# EasyEDA Pro project 电源拓展板.eprj

# Schematic Schematic1
Create Date: 2023-07-08; Page Name: P1; Project Name: 电源拓展板; Schematic Name: Schematic1; Update Date: 2023-07-08; Company: 嘉立创EDA; Page Size: A4; Version: V1.0
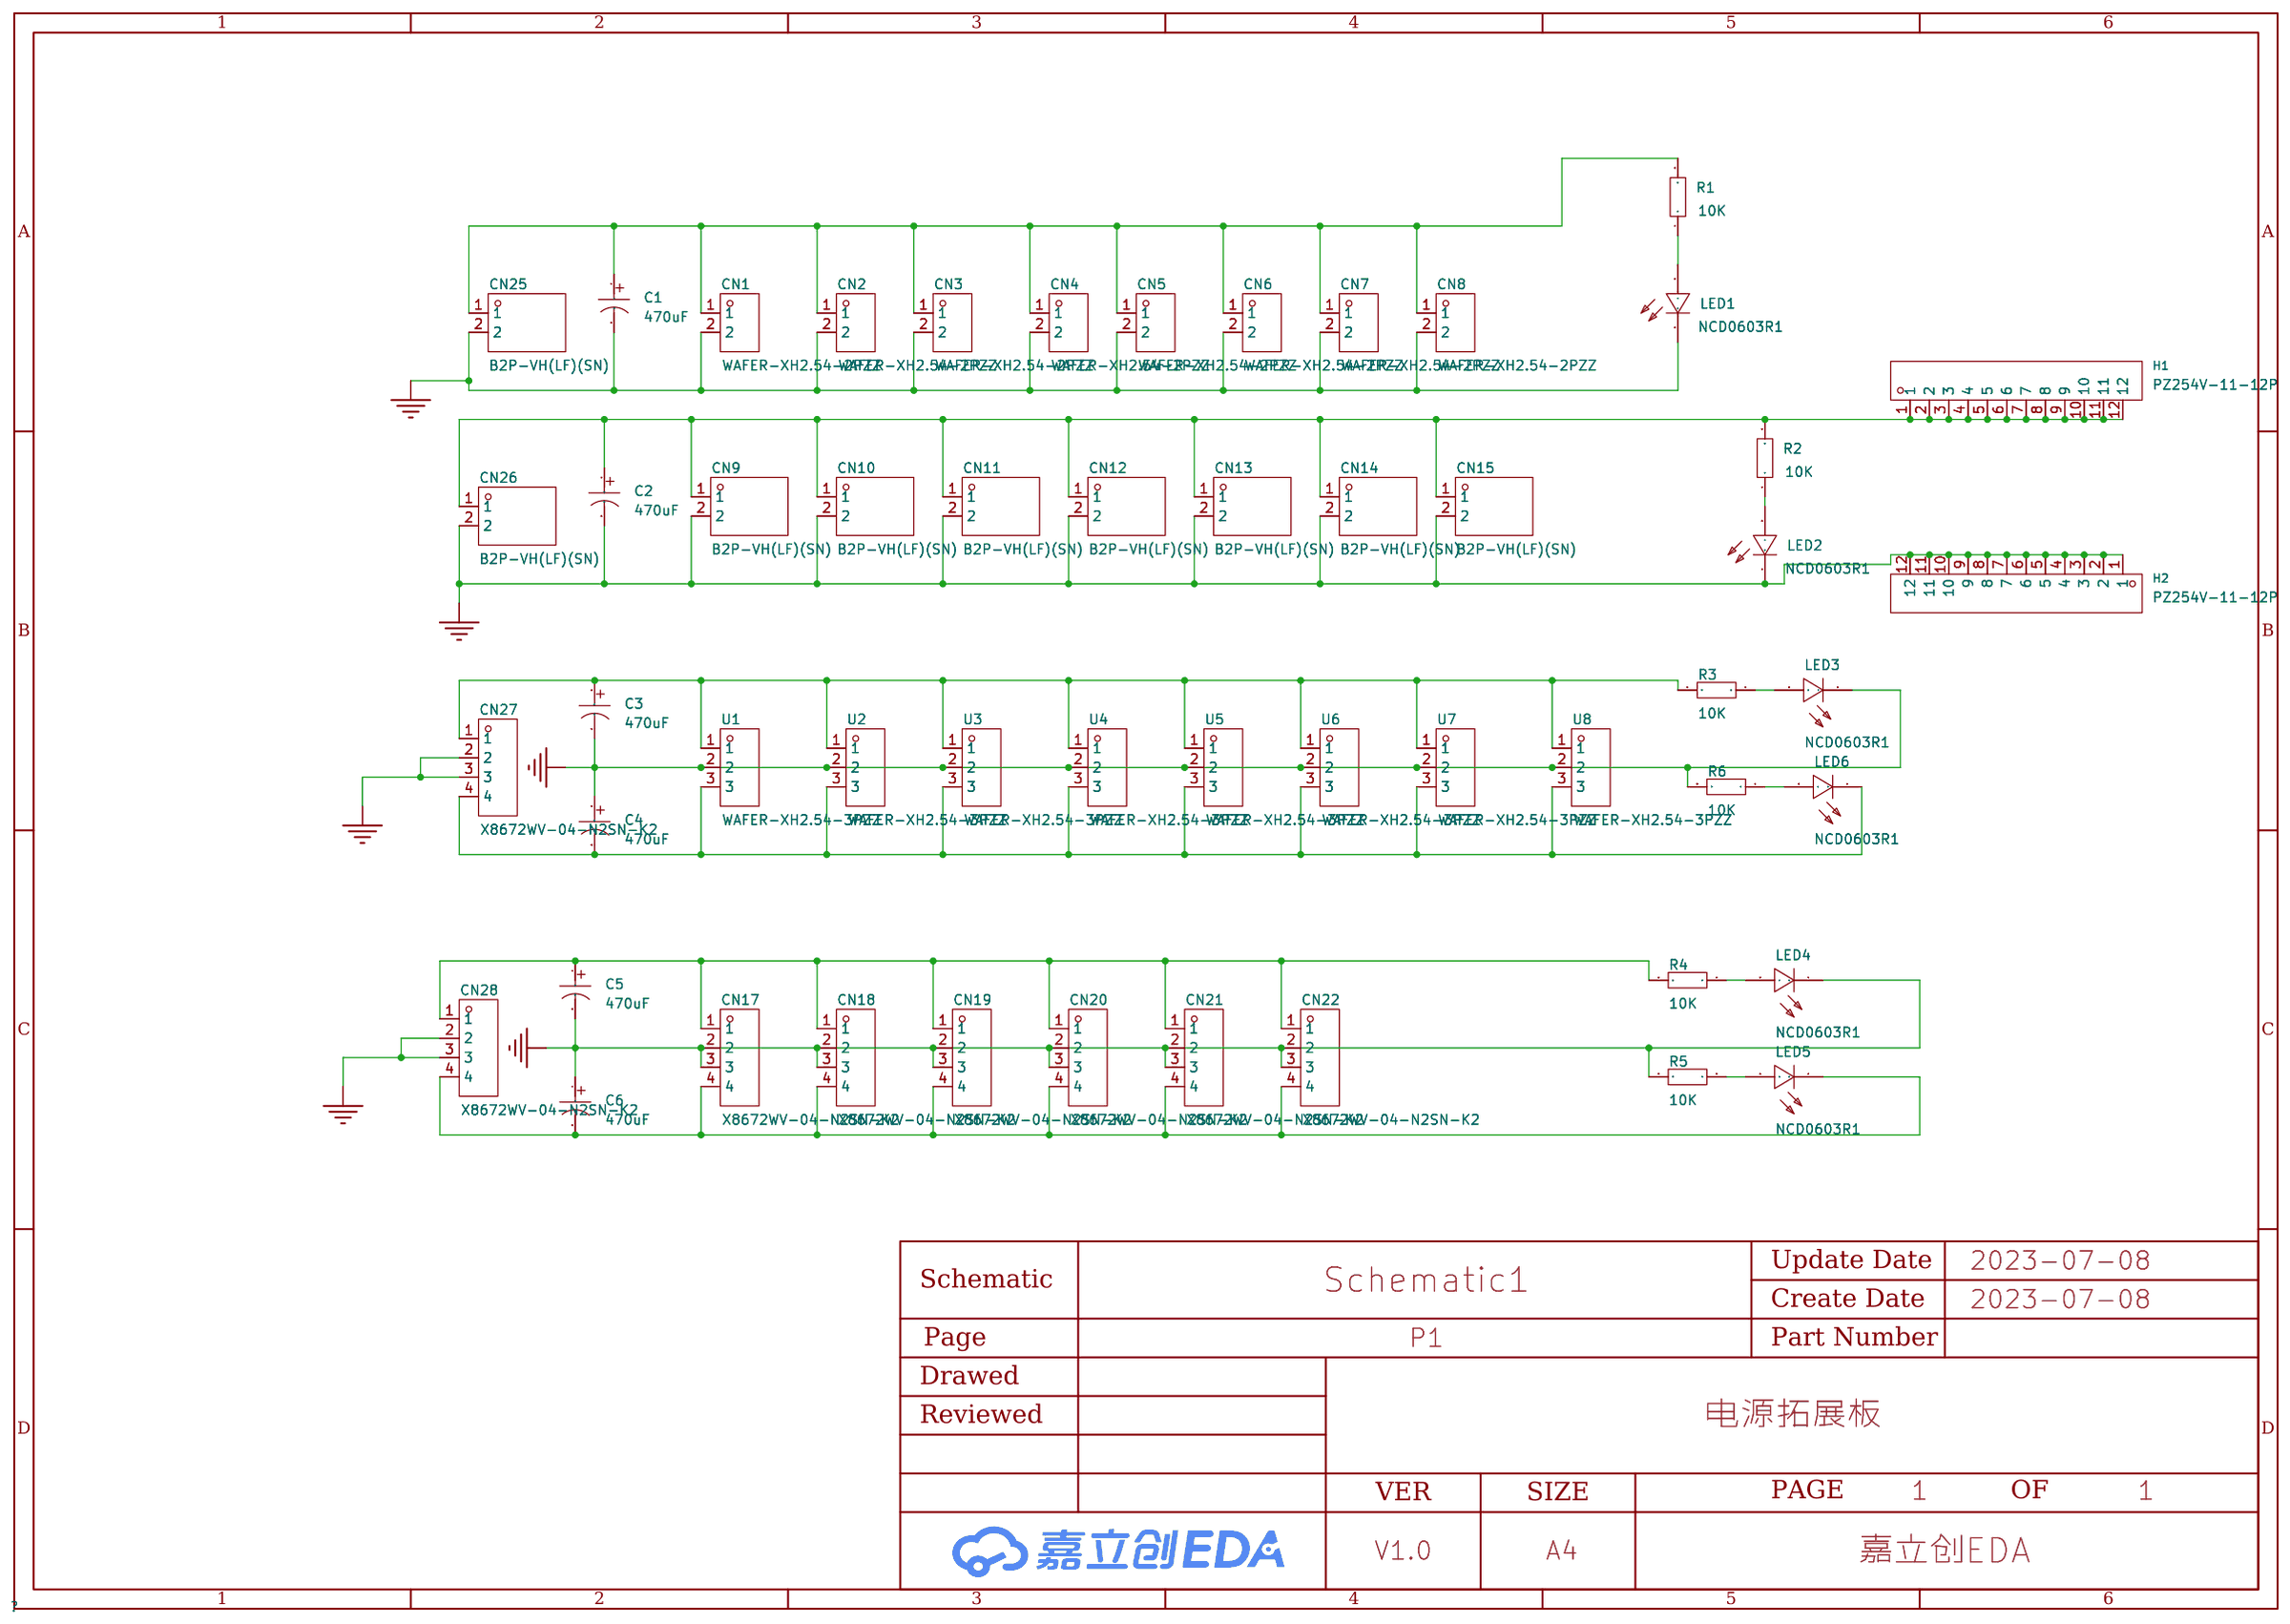
[diagram p0: schematic sheet]

## Parts
C1  470uF  [CAP-TH_BD8.0-P3.50-D0.6-FD]
C2  470uF  [CAP-TH_BD8.0-P3.50-D0.6-FD]
C3  470uF  [CAP-TH_BD8.0-P3.50-D0.6-FD]
C4  470uF  [CAP-TH_BD8.0-P3.50-D0.6-FD]
C5  470uF  [CAP-TH_BD8.0-P3.50-D0.6-FD]
C6  470uF  [CAP-TH_BD8.0-P3.50-D0.6-FD]
CN1  WAFER-XH2.54-2PZZ  [CONN-TH_XH2.54-2P]
CN2  WAFER-XH2.54-2PZZ  [CONN-TH_XH2.54-2P]
CN3  WAFER-XH2.54-2PZZ  [CONN-TH_XH2.54-2P]
CN4  WAFER-XH2.54-2PZZ  [CONN-TH_XH2.54-2P]
CN5  WAFER-XH2.54-2PZZ  [CONN-TH_XH2.54-2P]
CN6  WAFER-XH2.54-2PZZ  [CONN-TH_XH2.54-2P]
CN7  WAFER-XH2.54-2PZZ  [CONN-TH_XH2.54-2P]
CN8  WAFER-XH2.54-2PZZ  [CONN-TH_XH2.54-2P]
CN9  B2P-VH(LF)(SN)  [CONN-TH_B2P-VH-LF-SN]
CN10  B2P-VH(LF)(SN)  [CONN-TH_B2P-VH-LF-SN]
CN11  B2P-VH(LF)(SN)  [CONN-TH_B2P-VH-LF-SN]
CN12  B2P-VH(LF)(SN)  [CONN-TH_B2P-VH-LF-SN]
CN13  B2P-VH(LF)(SN)  [CONN-TH_B2P-VH-LF-SN]
CN14  B2P-VH(LF)(SN)  [CONN-TH_B2P-VH-LF-SN]
CN15  B2P-VH(LF)(SN)  [CONN-TH_B2P-VH-LF-SN]
CN17  X8672WV-04-N2SN-K2  [CONN-TH_4P-3.96_XKB_X8672WV-04-N2SN-K2]
CN18  X8672WV-04-N2SN-K2  [CONN-TH_4P-3.96_XKB_X8672WV-04-N2SN-K2]
CN19  X8672WV-04-N2SN-K2  [CONN-TH_4P-3.96_XKB_X8672WV-04-N2SN-K2]
CN20  X8672WV-04-N2SN-K2  [CONN-TH_4P-3.96_XKB_X8672WV-04-N2SN-K2]
CN21  X8672WV-04-N2SN-K2  [CONN-TH_4P-3.96_XKB_X8672WV-04-N2SN-K2]
CN22  X8672WV-04-N2SN-K2  [CONN-TH_4P-3.96_XKB_X8672WV-04-N2SN-K2]
CN25  B2P-VH(LF)(SN)  [CONN-TH_B2P-VH-LF-SN]
CN26  B2P-VH(LF)(SN)  [CONN-TH_B2P-VH-LF-SN]
CN27  X8672WV-04-N2SN-K2  [CONN-TH_4P-3.96_XKB_X8672WV-04-N2SN-K2]
CN28  X8672WV-04-N2SN-K2  [CONN-TH_4P-3.96_XKB_X8672WV-04-N2SN-K2]
H1  PZ254V-11-12P  [HDR-TH_12P-P2.54-V-M]
H2  PZ254V-11-12P  [HDR-TH_12P-P2.54-V-M]
LED1  NCD0603R1  [LED0603-RD_RED]
LED2  NCD0603R1  [LED0603-RD_RED]
LED3  NCD0603R1  [LED0603-RD_RED]
LED4  NCD0603R1  [LED0603-RD_RED]
LED5  NCD0603R1  [LED0603-RD_RED]
LED6  NCD0603R1  [LED0603-RD_RED]
R1  10K  [R0603]
R2  10K  [R0603]
R3  10K  [R0603]
R4  10K  [R0603]
R5  10K  [R0603]
R6  10K  [R0603]
U1  WAFER-XH2.54-3PZZ  [CONN-TH_3P-P2.50_WAFER-XH2.54-3PZZ]
U2  WAFER-XH2.54-3PZZ  [CONN-TH_3P-P2.50_WAFER-XH2.54-3PZZ]
U3  WAFER-XH2.54-3PZZ  [CONN-TH_3P-P2.50_WAFER-XH2.54-3PZZ]
U4  WAFER-XH2.54-3PZZ  [CONN-TH_3P-P2.50_WAFER-XH2.54-3PZZ]
U5  WAFER-XH2.54-3PZZ  [CONN-TH_3P-P2.50_WAFER-XH2.54-3PZZ]
U6  WAFER-XH2.54-3PZZ  [CONN-TH_3P-P2.50_WAFER-XH2.54-3PZZ]
U7  WAFER-XH2.54-3PZZ  [CONN-TH_3P-P2.50_WAFER-XH2.54-3PZZ]
U8  WAFER-XH2.54-3PZZ  [CONN-TH_3P-P2.50_WAFER-XH2.54-3PZZ]

## Library data of the parts
C1-C6 = 470uF 25V 8*12: 容值:470uF;精度:±20%;额定电压:25V;; LCSC Part Name: 470uF ±20% 25V; Supplier Part: C43839; Manufacturer: CX(承兴); Manufacturer Part: KM477M025F12RR0VH2FP0; Supplier Footprint: 插件,D8xL12mm; JLCPCB Part Class: Extended Part; Datasheet: https://atta.szlcsc.com/upload/public/pdf/source/20211027/06D6BA3719C264B639DC286D935D03EA.pdf; Supplier: LCSC; Tolerance: ±20%; Rated Voltage: 25V; φD: 8mm; L: 12mm; Lead Spacing: 3.5mm; Lifetime @ Temp: 2000hrs@105℃
CN1-CN8 = WAFER-XH2.54-2PZZ: 间距：2.54mm 插针结构：1x2P 排数：1 每排PIN数：2 公母：公型插针 安装方式：直插 额定电流：1A 工作温度范围：-25℃~+85℃  XH 2.54mm 1x2P 直插   配套：WAFER-XH2.54-2PJK  WAFER-XH2.54-DZ; LCSC Part Name: XH 2.54mm 1x2P 直插; Supplier Part: C5359631; Manufacturer: XUNPU(讯普); Supplier Footprint: 插件,P=2.54mm; JLCPCB Part Class: Extended Part; Datasheet: https://atta.szlcsc.com/upload/public/pdf/source/20230221/5D6483F9C7001DB87CFCFC787E1DC139.pdf; Supplier: LCSC
CN9-CN15 CN25 CN26 = B2P-VH (LF)(SN): 参考系列:VH;间距:3.96mm;插针结构:1x2P;排数:1;每排PIN数:2;行距:-;安装方式:-;触头材质:黄铜;; LCSC Part Name: VH 3.96mm 1x2P 直插; Supplier Part: C160315; Manufacturer: JST; Supplier Footprint: 插件,P=3.96mm; JLCPCB Part Class: Extended Part; Datasheet: https://atta.szlcsc.com/upload/public/pdf/source/20180420/C160315_19C451141449BB9E1CAF8D49BAD03192.pdf; Supplier: LCSC; Reference Series: VH; Pitch: 3.96mm; Pins Structure: 1x2P; Number of Rows: 1; Number of PINs Per Row: 2; Contact Material: 黄铜
CN17-CN22 CN27 CN28 = X8672WV-04-N2SN-K2: 参考系列:CH;间距:3.96mm;插针结构:1x4P;排数:1;每排PIN数:4;行距:-;公母:公型插针;安装方式:直插;额定电流:7A;触头材质:黄铜;触头镀层:锡;工作温度范围:-25℃~+85℃;焊接温度(最大值):260℃;; LCSC Part Name: CH 3.96mm 1x4P 直插; Supplier Part: C2884054; Manufacturer: XKB Connectivity(中国星坤); Supplier Footprint: 插件,P=3.96mm; JLCPCB Part Class: 扩展库; Datasheet: https://atta.szlcsc.com/upload/public/pdf/source/20211009/546112F564FD1FB1ABF34E80FC24DEC4.pdf; Supplier: LCSC; Reference Series: CH; Pitch: 3.96mm; Pins Structure: 1x4P; Number of Rows: 1; Number of PINs Per Row: 4; Gender: 公型插针; Mounting Style: 直插; Current Rating (Max): 7A; Contact Material: 黄铜; Contact Plating: 锡; Operating Temperature Range: -25℃~+85℃; Welding Temperature (Max): 260℃
H1 H2 = PZ254V-11-12P: 排数:单排;总PIN位数:12P;间距:2.54mm;插针结构:1x12P;行距:-;安装类型:直插;圆针/方针:方针;额定电流:3A;额定电压:250V;配合针长度:6mm;塑高:2.5mm;端接针长度:3mm;触头材质:-;工作温度范围:-40℃~+105℃;颜色:黑色;; LCSC Part Name: 2.54mm 1x12P 直插 方针; Supplier Part: C2840012; Manufacturer: XFCN(兴飞); Supplier Footprint: 插件,P=2.54mm; JLCPCB Part Class: 扩展库; Datasheet: https://atta.szlcsc.com/upload/public/pdf/source/20200309/C492403_F9F19131791D08044AD4F84F8E751A34.pdf; Supplier: LCSC; Number of Rows: 单排; Number of Pins: 12P; Pitch: 2.54mm; Pin Structure: 1x12P; Mounting Type: 直插; Circluar Pins/Square Pins: 方针; Current Rating (Max): 3A; Voltage Rating (Max): 250V; Length of Mating Pin: 6mm; Insulation Height: 2.5mm; Length of End Connection Pin: 3mm; Operating Temperature Range: -40℃~+105℃; Color: 黑色
LED1-LED6 = NCD0603R1_C84263: 发光颜色:红灯;; LCSC Part Name: 红灯; Supplier Part: C84263; Manufacturer: 国星光电; Supplier Footprint: 0603; JLCPCB Part Class: 扩展库; Datasheet: https://atta.szlcsc.com/upload/public/pdf/source/20200820/C84263_DABC6A75E58F576973B407FDBA283D60.pdf; Supplier: LCSC; Emitted Color: 红灯
R1-R6 = Res_0603: Supplier Footprint: 0603
U1-U8 = WAFER-XH2.54-3PZZ: 间距：2.54mm 插针结构：1x3P 排数：1 每排PIN数：3 公母：公型插针 安装方式：直插 额定电流：1A 工作温度范围：-25℃~+85℃  XH 2.54mm 1x3P 直插   配套：WAFER-XH2.54-3PJK  WAFER-XH2.54-DZ; LCSC Part Name: XH 2.54mm 1x3P 直插; Supplier Part: C5374805; Manufacturer: XUNPU(讯普); Supplier Footprint: 插件,P=2.5mm; JLCPCB Part Class: 扩展库; Datasheet: https://atta.szlcsc.com/upload/public/pdf/source/20230221/BB2BB5DC1137DF188ABB0719250413B0.pdf; Supplier: LCSC

## Nets
GND: C1.2 C2.2 C3.2 C4.1 C5.2 C6.1 CN1.2 CN2.2 CN3.2 CN4.2 CN5.2 CN6.2 CN7.2 CN8.2 CN9.2 CN10.2 CN11.2 CN12.2 CN13.2 CN14.2 CN15.2 CN17.2 CN17.3 CN18.2 CN18.3 CN19.2 CN19.3 CN20.2 CN20.3 CN21.2 CN21.3 CN22.2 CN22.3 CN25.2 CN26.2 CN27.2 CN27.3 CN28.2 CN28.3 H2.1 H2.2 H2.3 H2.4 H2.5 H2.6 H2.7 H2.8 H2.9 H2.10 H2.11 H2.12 LED1.1(K) LED2.1(K) LED3.1(K) LED4.1(K) R5.2 R6.2 U1.2 U2.2 U3.2 U4.2 U5.2 U6.2 U7.2 U8.2
$1N3955: C1.1 CN1.1 CN2.1 CN3.1 CN4.1 CN5.1 CN6.1 CN7.1 CN8.1 CN25.1 R1.2
$1N6326: C3.1 CN27.1 R3.2 U1.1 U2.1 U3.1 U4.1 U5.1 U6.1 U7.1 U8.1
$1N8561: C5.1 CN17.1 CN18.1 CN19.1 CN20.1 CN21.1 CN22.1 CN28.1 R4.2
$1N15760: C2.1 CN9.1 CN10.1 CN11.1 CN12.1 CN13.1 CN14.1 CN15.1 CN26.1 H1.1 H1.2 H1.3 H1.4 H1.5 H1.6 H1.7 H1.8 H1.9 H1.10 H1.11 H1.12 R2.2
Net-(C4-2): C4.2 CN27.4 LED6.1(K) U1.3 U2.3 U3.3 U4.3 U5.3 U6.3 U7.3 U8.3
Net-(C6-2): C6.2 CN17.4 CN18.4 CN19.4 CN20.4 CN21.4 CN22.4 CN28.4 LED5.1(K)
Net-(LED1-2): LED1.2(A) R1.1
Net-(LED2-2): LED2.2(A) R2.1
Net-(LED3-2): LED3.2(A) R3.1
Net-(LED4-2): LED4.2(A) R4.1
Net-(LED5-2): LED5.2(A) R5.1
Net-(LED6-2): LED6.2(A) R6.1

# Board PCB1
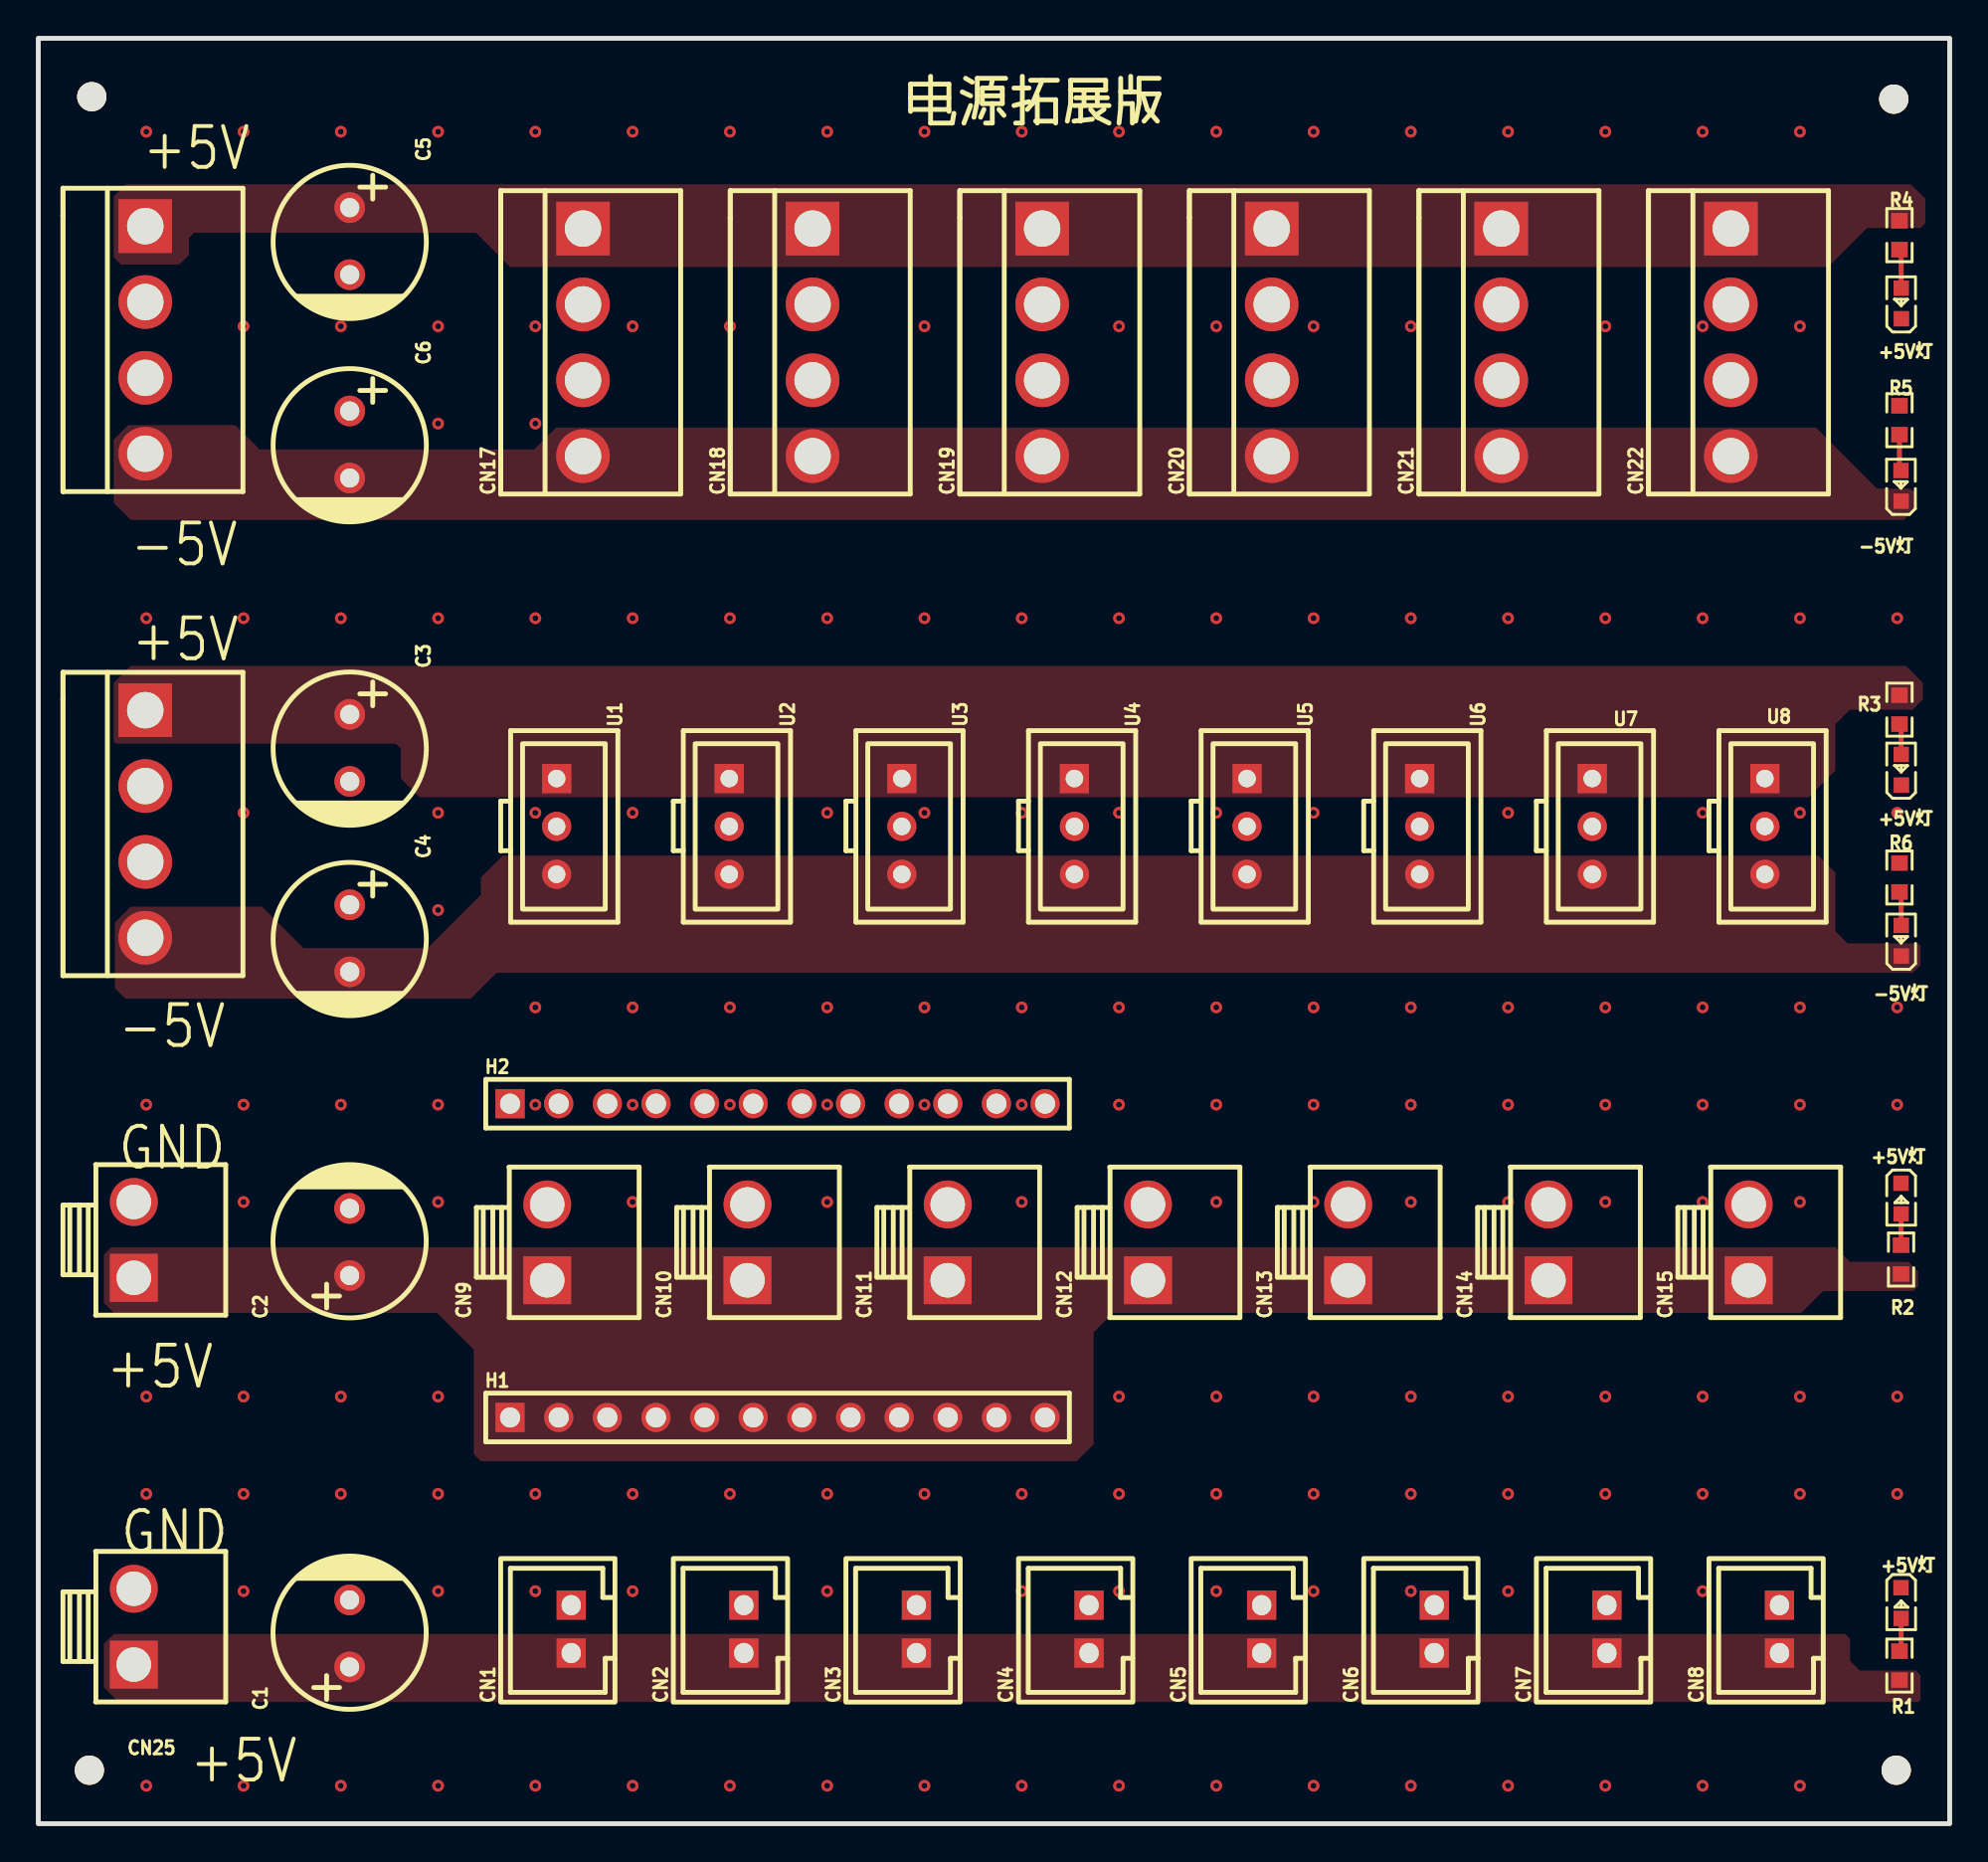
[diagram p1: board, top side]
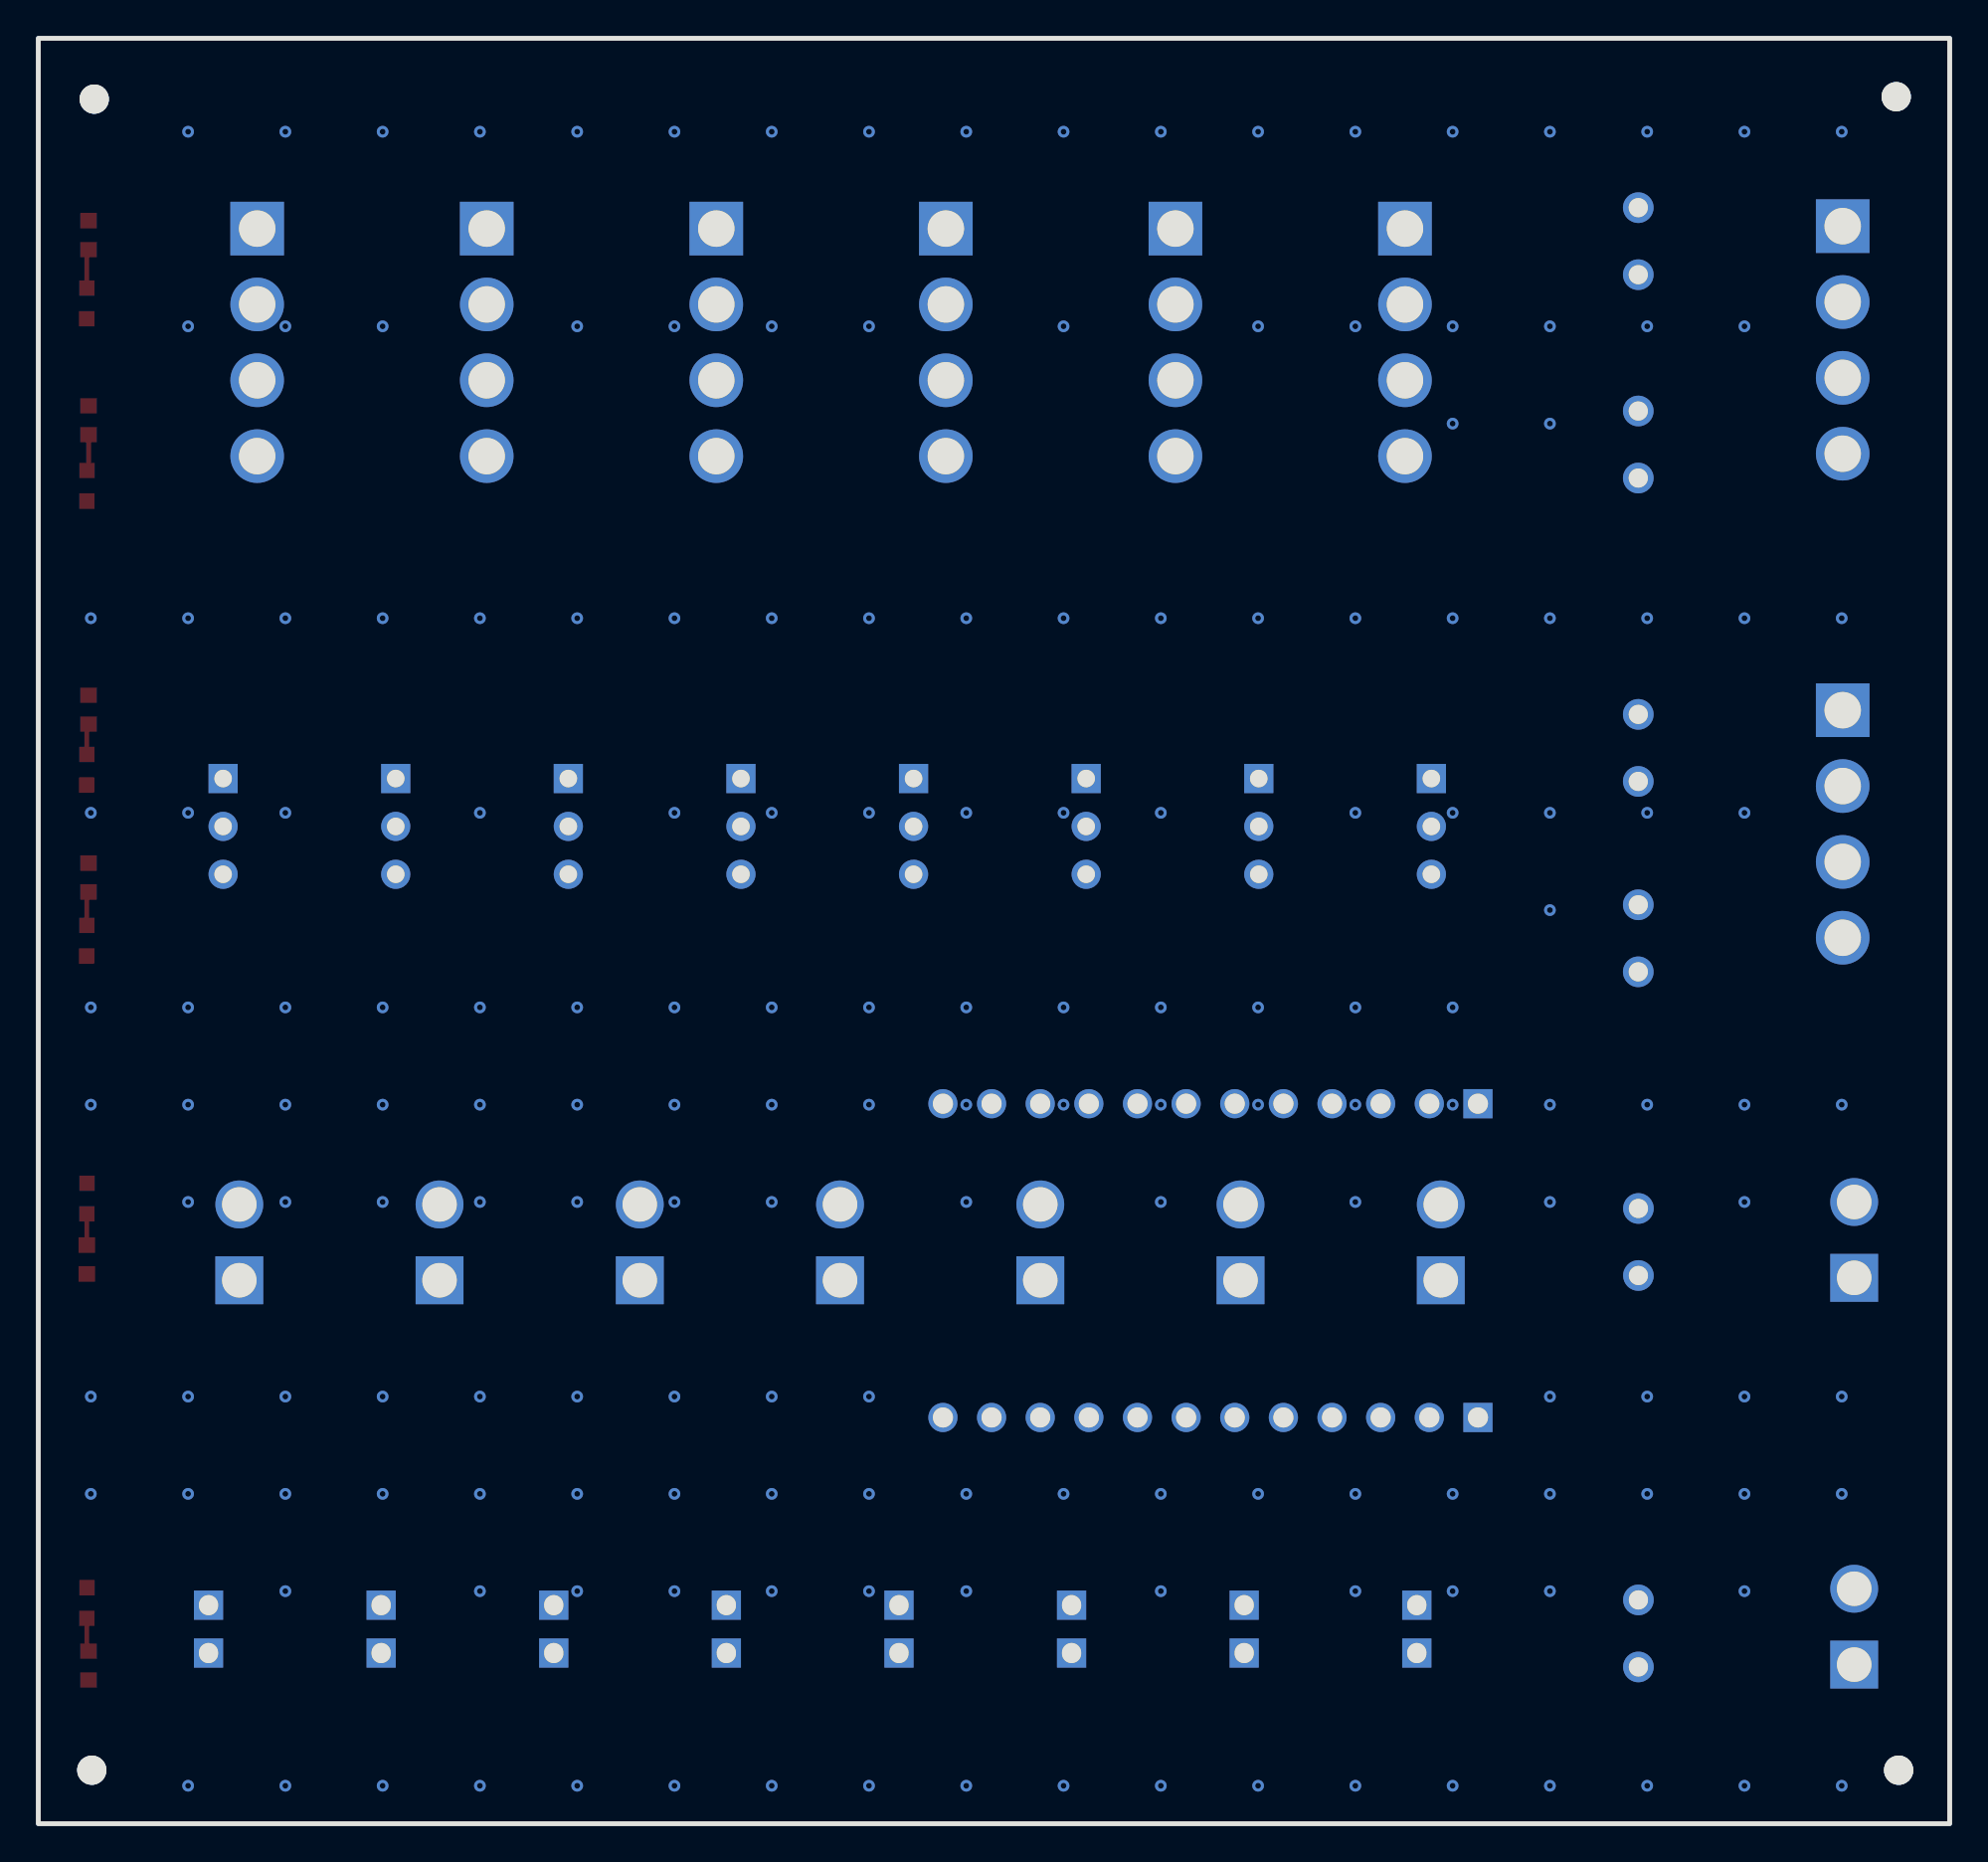
[diagram p2: board, bottom side, seen from below]

Outline 99.82 x 93.22 mm; copper layers: Top Layer, Bottom Layer. Coordinates in mm from the lower left corner of the outline.
Outline path: rectangle 0,93.22 99.82,0
Stack: Top Layer 0.035mm / Dielectric1 1.51mm FR4 er 4.5 / Bottom Layer 0.035mm

## Design rules (mm)
spacing safeClearance (default): track to track 0.152, other pairs 0.152 to 0.3
track width trackWidth (default): min 0.127, default 0.254, max 2.54
differential pair differentialPair (default): width min 0.127, default 0.254, max 2.54; gap min 0.152, default 0.152
via viaSize (default): diameter min 0.5, default 0.61, max 10; hole min 0.3, default 0.305, max 6

## Placement (name value [footprint] x y rotation side)
+5V灯  -  [LED0603-RD_RED]  97.28 11.52 270 top
+5V灯#2  -  [LED0603-RD_RED]  97.28 32.64 270 top
+5V灯#3  -  [LED0603-RD_RED]  97.29 55.03 90 top
+5V灯#4  -  [LED0603-RD_RED]  97.29 79.38 90 top
-5V灯  -  [LED0603-RD_RED]  97.28 69.85 90 top
-5V灯#2  -  [LED0603-RD_RED]  97.29 46.1 90 top
C1  470uF  [CAP-TH_BD8.0-P3.50-D0.6-FD]  16.26 9.93 90 top
C2  470uF  [CAP-TH_BD8.0-P3.50-D0.6-FD]  16.26 30.37 90 top
C3  470uF  [CAP-TH_BD8.0-P3.50-D0.6-FD]  16.26 56.17 270 top
C4  470uF  [CAP-TH_BD8.0-P3.50-D0.6-FD]  16.26 46.23 270 top
C5  470uF  [CAP-TH_BD8.0-P3.50-D0.6-FD]  16.26 82.63 270 top
C6  470uF  [CAP-TH_BD8.0-P3.50-D0.6-FD]  16.26 72.01 270 top
CN1  WAFER-XH2.54-2PZZ  [CONN-TH_XH2.54-2P]  27.83 10.16 90 top
CN2  WAFER-XH2.54-2PZZ  [CONN-TH_XH2.54-2P]  36.85 10.16 90 top
CN3  WAFER-XH2.54-2PZZ  [CONN-TH_XH2.54-2P]  45.86 10.16 90 top
CN4  WAFER-XH2.54-2PZZ  [CONN-TH_XH2.54-2P]  54.87 10.16 90 top
CN5  WAFER-XH2.54-2PZZ  [CONN-TH_XH2.54-2P]  63.89 10.16 90 top
CN6  WAFER-XH2.54-2PZZ  [CONN-TH_XH2.54-2P]  72.9 10.16 90 top
CN7  WAFER-XH2.54-2PZZ  [CONN-TH_XH2.54-2P]  81.92 10.16 90 top
CN8  WAFER-XH2.54-2PZZ  [CONN-TH_XH2.54-2P]  90.93 10.16 90 top
CN9  B2P-VH(LF)(SN)  [CONN-TH_B2P-VH-LF-SN]  26.58 30.35 90 top
CN10  B2P-VH(LF)(SN)  [CONN-TH_B2P-VH-LF-SN]  37.04 30.35 90 top
CN11  B2P-VH(LF)(SN)  [CONN-TH_B2P-VH-LF-SN]  47.49 30.35 90 top
CN12  B2P-VH(LF)(SN)  [CONN-TH_B2P-VH-LF-SN]  57.95 30.35 90 top
CN13  B2P-VH(LF)(SN)  [CONN-TH_B2P-VH-LF-SN]  68.41 30.35 90 top
CN14  B2P-VH(LF)(SN)  [CONN-TH_B2P-VH-LF-SN]  78.87 30.35 90 top
CN15  B2P-VH(LF)(SN)  [CONN-TH_B2P-VH-LF-SN]  89.33 30.35 90 top
CN17  X8672WV-04-N2SN-K2  [CONN-TH_4P-3.96_XKB_X8672WV-04-N2SN-K2]  28.45 77.34 90 top
CN18  X8672WV-04-N2SN-K2  [CONN-TH_4P-3.96_XKB_X8672WV-04-N2SN-K2]  40.44 77.34 90 top
CN19  X8672WV-04-N2SN-K2  [CONN-TH_4P-3.96_XKB_X8672WV-04-N2SN-K2]  52.43 77.34 90 top
CN20  X8672WV-04-N2SN-K2  [CONN-TH_4P-3.96_XKB_X8672WV-04-N2SN-K2]  64.41 77.34 90 top
CN21  X8672WV-04-N2SN-K2  [CONN-TH_4P-3.96_XKB_X8672WV-04-N2SN-K2]  76.4 77.34 90 top
CN22  X8672WV-04-N2SN-K2  [CONN-TH_4P-3.96_XKB_X8672WV-04-N2SN-K2]  88.39 77.34 90 top
CN25  B2P-VH(LF)(SN)  [CONN-TH_B2P-VH-LF-SN]  4.99 10.29 90 top
CN26  B2P-VH(LF)(SN)  [CONN-TH_B2P-VH-LF-SN]  4.99 30.48 90 top
CN27  X8672WV-04-N2SN-K2  [CONN-TH_4P-3.96_XKB_X8672WV-04-N2SN-K2]  5.59 52.2 90 top
CN28  X8672WV-04-N2SN-K2  [CONN-TH_4P-3.96_XKB_X8672WV-04-N2SN-K2]  5.59 77.47 90 top
H1  PZ254V-11-12P  [HDR-TH_12P-P2.54-V-M]  38.61 21.21 0 top
H2  PZ254V-11-12P  [HDR-TH_12P-P2.54-V-M]  38.61 37.59 0 top
NOREF  -  [Pad_e7]  97.03 2.79 0 top
NOREF#2  -  [Pad_e6]  96.9 90.04 0 top
NOREF#3  -  [Pad_e1]  2.79 90.17 0 top
NOREF#4  -  [Pad_e8]  2.67 2.79 0 top
R1  10K  [R0603]  97.2 8.25 270 top
R2  10K  [R0603]  97.28 29.46 270 top
R3  10K  [R0603]  97.2 58.17 90 top
R4  10K  [R0603]  97.2 82.94 90 top
R5  10K  [R0603]  97.2 73.28 90 top
R6  10K  [R0603]  97.2 49.4 90 top
U1  WAFER-XH2.54-3PZZ  [CONN-TH_3P-P2.50_WAFER-XH2.54-3PZZ]  27.07 52.07 270 top
U2  WAFER-XH2.54-3PZZ  [CONN-TH_3P-P2.50_WAFER-XH2.54-3PZZ]  36.08 52.07 270 top
U3  WAFER-XH2.54-3PZZ  [CONN-TH_3P-P2.50_WAFER-XH2.54-3PZZ]  45.1 52.07 270 top
U4  WAFER-XH2.54-3PZZ  [CONN-TH_3P-P2.50_WAFER-XH2.54-3PZZ]  54.11 52.07 270 top
U5  WAFER-XH2.54-3PZZ  [CONN-TH_3P-P2.50_WAFER-XH2.54-3PZZ]  63.13 52.07 270 top
U6  WAFER-XH2.54-3PZZ  [CONN-TH_3P-P2.50_WAFER-XH2.54-3PZZ]  72.14 52.07 270 top
U7  WAFER-XH2.54-3PZZ  [CONN-TH_3P-P2.50_WAFER-XH2.54-3PZZ]  81.16 52.07 270 top
U8  WAFER-XH2.54-3PZZ  [CONN-TH_3P-P2.50_WAFER-XH2.54-3PZZ]  90.17 52.07 270 top

## Footprints (pads in the part's own frame, mm; a bottom-side part is the same pattern mirrored in y, then rotated)
CAP-TH_BD8.0-P3.50-D0.6-FD
  round 1.6 hole 1: 1(-1.75,0) 2(1.75,0)
CONN-TH_3P-P2.50_WAFER-XH2.54-3PZZ
  rect 1.524x1.524 hole 0.914: 1(-2.5,0)
  round 1.524 hole 0.914: 2(0,0) 3(2.5,0)
CONN-TH_4P-3.96_XKB_X8672WV-04-N2SN-K2
  rect 2.8x2.8 hole 1.9: 1(5.94,0)
  round 2.8 hole 1.9: 2(1.98,0) 3(-1.98,0) 4(-5.94,0)
CONN-TH_B2P-VH-LF-SN
  rect 2.5x2.5 hole 1.8: 1(-1.98,0)
  round 2.5 hole 1.8: 2(1.98,0)
CONN-TH_XH2.54-2P
  rect 1.524x1.524 hole 1.05x1: 1(-1.25,0) 2(1.25,0)
HDR-TH_12P-P2.54-V-M
  rect 1.524x1.524 hole 1.05: 1(-13.97,0)
  round 1.524 hole 1.05: 2(-11.43,0) 3(-8.89,0) 4(-6.35,0) 5(-3.81,0) 6(-1.27,0) 7(1.27,0) 8(3.81,0) 9(6.35,0) 10(8.89,0) 11(11.43,0) 12(13.97,0)
LED0603-RD_RED
  rect 0.8x0.8 smd: 1(-0.799,-0.004) 2(0.799,0.004)
Pad_e1
  round 1.524 hole 3: 1(0,0)
Pad_e6
  round 1.524 hole 3: 1(0,0)
Pad_e7
  round 1.524 hole 3: 1(0,0)
Pad_e8
  round 1.524 hole 3: 1(0,0)
R0603
  rect 0.806x0.864 smd: 1(-0.753,0) 2(0.753,0)

## Nets
GND: +5V灯.1 +5V灯#2.1 +5V灯#3.1 +5V灯#4.1 C1.2 C2.2 C3.2 C4.1 C5.2 C6.1 CN1.2 CN2.2 CN3.2 CN4.2 CN5.2 CN6.2 CN7.2 CN8.2 CN9.2 CN10.2 CN11.2 CN12.2 CN13.2 CN14.2 CN15.2 CN17.2 CN17.3 CN18.2 CN18.3 CN19.2 CN19.3 CN20.2 CN20.3 CN21.2 CN21.3 CN22.2 CN22.3 CN25.2 CN26.2 CN27.2 CN27.3 CN28.2 CN28.3 H2.1 H2.2 H2.3 H2.4 H2.5 H2.6 H2.7 H2.8 H2.9 H2.10 H2.11 H2.12 R5.2 R6.2 U1.2 U2.2 U3.2 U4.2 U5.2 U6.2 U7.2 U8.2
$1N3955: C1.1 CN1.1 CN2.1 CN3.1 CN4.1 CN5.1 CN6.1 CN7.1 CN8.1 CN25.1 R1.2
$1N6326: C3.1 CN27.1 R3.2 U1.1 U2.1 U3.1 U4.1 U5.1 U6.1 U7.1 U8.1
$1N6733: -5V灯#2.1 C4.2 CN27.4 U1.3 U2.3 U3.3 U4.3 U5.3 U6.3 U7.3 U8.3
$1N8561: C5.1 CN17.1 CN18.1 CN19.1 CN20.1 CN21.1 CN22.1 CN28.1 R4.2
$1N8562: -5V灯.1 C6.2 CN17.4 CN18.4 CN19.4 CN20.4 CN21.4 CN22.4 CN28.4
$1N13181: +5V灯.2 R1.1
$1N13434: +5V灯#2.2 R2.1
$1N13693: +5V灯#3.2 R3.1
$1N13994: -5V灯#2.2 R6.1
$1N14265: +5V灯#4.2 R4.1
$1N14566: -5V灯.2 R5.1
$1N15760: C2.1 CN9.1 CN10.1 CN11.1 CN12.1 CN13.1 CN14.1 CN15.1 CN26.1 H1.1 H1.2 H1.3 H1.4 H1.5 H1.6 H1.7 H1.8 H1.9 H1.10 H1.11 H1.12 R2.2

Pads without a net: NOREF 1; NOREF#2 1; NOREF#3 1; NOREF#4 1

## Via types
v1: diameter 0.61, hole 0.304, Top Layer to Bottom Layer, 177 vias

## Routing (per net, layer and track width the routed paths; a pad name or vN(x,y) marks a point on that pad's centre or on a via; arc(x,y) is an arc through that point)
GND:
  vias: v1(5.64,88.34) v1(5.64,62.94) v1(5.64,37.54) v1(5.64,22.3) v1(5.64,17.22) v1(5.64,1.98) v1(10.72,88.34) v1(10.72,78.18) v1(10.72,62.94) v1(10.72,52.78) v1(10.72,37.54) v1(10.72,32.46) v1(10.72,22.3) v1(10.72,17.22) v1(10.72,12.14) v1(10.72,1.98) v1(15.8,88.34) v1(15.8,78.18) v1(15.8,62.94) v1(15.8,52.78) v1(15.8,37.54) v1(15.8,22.3) v1(15.8,17.22) v1(15.8,1.98) v1(20.88,88.34) v1(20.88,78.18) v1(20.88,73.1) v1(20.88,62.94) v1(20.88,52.78) v1(20.88,47.7) v1(20.88,37.54) v1(20.88,32.46) v1(20.88,22.3) v1(20.88,17.22) v1(20.88,12.14) v1(20.88,1.98) v1(25.96,88.34) v1(25.96,78.18) v1(25.96,73.1) v1(25.96,62.94) v1(25.96,52.78) v1(25.96,42.62) v1(25.96,37.54) v1(25.96,17.22) v1(25.96,12.14) v1(25.96,1.98) v1(31.04,88.34) v1(31.04,78.18) v1(31.04,62.94) v1(31.04,52.78) v1(31.04,42.62) v1(31.04,37.54) v1(31.04,32.46) v1(31.04,17.22) v1(31.04,12.14) v1(31.04,1.98) v1(36.12,88.34) v1(36.12,78.18) v1(36.12,62.94) v1(36.12,42.62) v1(36.12,37.54) v1(36.12,17.22) v1(36.12,1.98) v1(41.2,88.34) v1(41.2,62.94) v1(41.2,52.78) v1(41.2,42.62) v1(41.2,37.54) v1(41.2,32.46) v1(41.2,17.22) v1(41.2,12.14) v1(41.2,1.98) v1(46.28,88.34) v1(46.28,78.18) v1(46.28,62.94) v1(46.28,52.78) v1(46.28,42.62) v1(46.28,37.54) v1(46.28,17.22) v1(46.28,1.98) v1(51.36,88.34) v1(51.36,62.94) v1(51.36,52.78) v1(51.36,42.62) v1(51.36,37.54) v1(51.36,32.46) v1(51.36,17.22) v1(51.36,12.14) v1(51.36,1.98) v1(56.44,88.34) v1(56.44,78.18) v1(56.44,62.94) v1(56.44,52.78) v1(56.44,42.62) v1(56.44,37.54) v1(56.44,22.3) v1(56.44,17.22) v1(56.44,12.14) v1(56.44,1.98) v1(61.52,88.34) v1(61.52,78.18) v1(61.52,62.94) v1(61.52,52.78) v1(61.52,42.62) v1(61.52,37.54) v1(61.52,32.46) v1(61.52,22.3) v1(61.52,17.22) v1(61.52,12.14) v1(61.52,1.98) v1(66.6,88.34) v1(66.6,78.18) v1(66.6,62.94) v1(66.6,52.78) v1(66.6,42.62) v1(66.6,37.54) v1(66.6,32.46) v1(66.6,22.3) v1(66.6,17.22) v1(66.6,12.14) v1(66.6,1.98) v1(71.68,88.34) v1(71.68,78.18) v1(71.68,62.94) v1(71.68,42.62) v1(71.68,37.54) v1(71.68,32.46) v1(71.68,22.3) v1(71.68,17.22) v1(71.68,12.14) v1(71.68,1.98) v1(76.76,88.34) v1(76.76,62.94) v1(76.76,52.78) v1(76.76,42.62) v1(76.76,37.54) v1(76.76,32.46) v1(76.76,22.3) v1(76.76,17.22) v1(76.76,12.14) v1(76.76,1.98) v1(81.84,88.34) v1(81.84,78.18) v1(81.84,62.94) v1(81.84,42.62) v1(81.84,37.54) v1(81.84,32.46) v1(81.84,22.3) v1(81.84,17.22) v1(81.84,1.98) v1(86.92,88.34) v1(86.92,78.18) v1(86.92,62.94) v1(86.92,52.78) v1(86.92,42.62) v1(86.92,37.54) v1(86.92,32.46) v1(86.92,22.3) v1(86.92,17.22) v1(86.92,12.14) v1(86.92,1.98) v1(92,88.34) v1(92,78.18) v1(92,62.94) v1(92,52.78) v1(92,42.62) v1(92,37.54) v1(92,32.46) v1(92,22.3) v1(92,17.22) v1(92,1.98) v1(97.08,62.94) v1(97.08,52.78) v1(97.08,42.62) v1(97.08,37.54) v1(97.08,22.3) v1(97.08,17.22)
$1N13181: length 1.7
  Top Layer w0.254: +5V灯.2 97.29,9.1 R1.1
$1N13434: length 1.6
  Top Layer w0.254: R2.1 97.29,30.21 +5V灯#2.2
$1N13693: length 1.6
  Top Layer w0.254: 97.29,55.83 97.29,57.32 R3.1
$1N13994: length 1.8
  Top Layer w0.254: R6.1 97.29,48.56 -5V灯#2.2
$1N14265: length 2
  Top Layer w0.254: 97.2,82.19 97.29,82.09 +5V灯#4.2
$1N14566: length 1.9
  Top Layer w0.254: -5V灯.2 97.2,70.73 R5.1

## Copper pours and planes (outline as drawn; the poured copper is in the pictures)
GND on Top Layer: -12.83,93.98 106.55,93.98 106.55,-12.83 -12.83,-12.83
GND on Bottom Layer: -13.72,100.33 107.19,100.33 107.19,-11.05 -13.72,-11.05
$1N3955 on Top Layer: 3.43,9.91 98.3,9.91 98.3,6.35 3.43,6.35
$1N6326 on Top Layer: 3.94,60.45 98.42,60.45 98.42,53.59 3.94,53.59
$1N6733 on Top Layer: 3.99,50.55 98.3,50.55 98.3,43.07 3.99,43.07
$1N8561 on Top Layer: 3.94,85.6 98.55,85.6 98.55,81.28 3.94,81.28
$1N8562 on Top Layer: 3.94,73.03 98.03,73.03 98.03,68.07 3.94,68.07
$1N15760 on Top Layer: 3.43,30.1 98.17,30.1 98.17,26.67 3.43,26.67
$1N15760 on Top Layer: 19.94,27.56 56.39,27.56 56.39,18.92 19.94,18.92

Small or netless copper shapes (teardrops, artwork), in the pictures only: 2 on Top Layer

## Text on the board
Top Silkscreen Layer: +5V | -5V | GND | 电源拓展版
